# Altium schematic sheet Sensor_Input.SchDoc
size A4; Organization: Altium Limited; Address1: L3, 12a Rodborough Rd; Address2: Frenchs Forest; Address3: NSW; Address4: Australia 2086
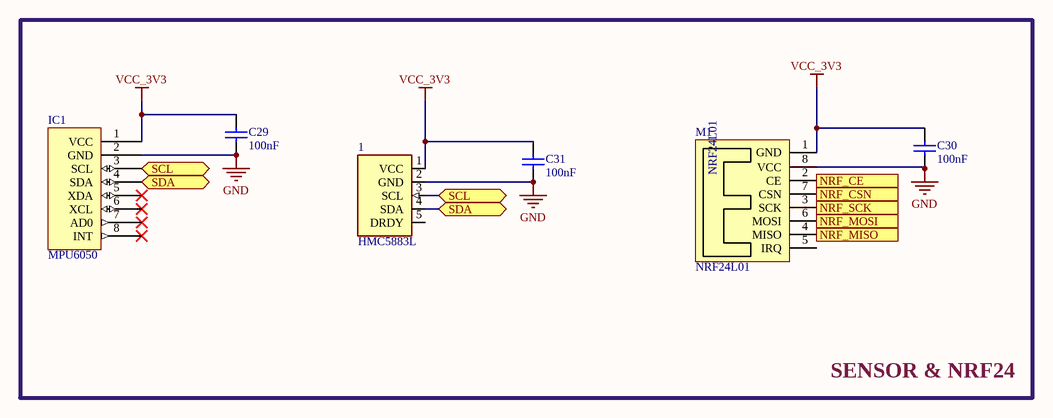
[diagram p0: Sensor_Input.SchDoc]

## Parts
1  HMC5883L  [HMC5883L]
C29  value 100nF  [CAP-SM-0805]  (hidden comment: Cap Non-Pol SMD)
C30  value 100nF  [CAP-SM-0805]  (hidden comment: Cap Non-Pol SMD)
C31  value 100nF  [CAP-SM-0805]  (hidden comment: Cap Non-Pol SMD)
IC1  MPU6050  [MPU6050_H]
M1  NRF24L01  [NRF24L01]

## Blocks framed on the sheet
SENSOR & NRF24: 1 C29-C31 IC1 M1

## Ports
NRF_CE (in), NRF_CSN (in), NRF_MISO (out), NRF_MOSI (in), NRF_SCK (in), SCL (bidir), SDA (bidir)

## Nets
GND: 1.2(GND) C29.1 C30.1 C31.1 IC1.2(GND) M1.8(VCC)
VCC_3V3: 1.1(VCC) C29.2 C30.2 C31.2 IC1.1(VCC) M1.1(GND)
NRF_CE: M1.2(CE) ; port NRF_CE
NRF_CSN: M1.7(CSN) ; port NRF_CSN
NRF_MISO: M1.4(MISO) ; port NRF_MISO
NRF_MOSI: M1.6(MOSI) ; port NRF_MOSI
NRF_SCK: M1.3(SCK) ; port NRF_SCK
SCL: 1.3(SCL) IC1.3(SCL) ; port SCL
SDA: 1.4(SDA) IC1.4(SDA) ; port SDA

Not connected (* = marked no-connect by the designer): 1 5(DRDY); IC1 5(XDA)* 6(XCL)* 7(AD0)* 8(INT)*; M1 5(IRQ)

## Notes on the sheet
- Title
- Size:
- Date:
- A4
- Number:
- Time:
- Revision:
- Sheet
- of
- File:

## Library data of the parts
1 = HMC5883L: HMC5883L HMC Magnetic, Digital Compass Sensor Evaluation Board; MF: Honeywell Aerospace; Availability: Unavailable; SnapEDA_Link: https://www.snapeda.com/parts/HMC5883L/Honeywell%20Aerospace/view-part/106081/?ref=snap; MP: HMC5883L; Price: None; Package: LCC-16 Honeywell; Value: *
C29-C31 = Cap Non-Pol SMD: Capacitor
IC1 = IMU MPU6050: GY-521 6DOF IMU MPU6050 / TECHMT.VN; WEB: TECHMT.VN